# Altium schematic sheet Sensored BLDC Driver PCB.SchDoc
size A4; SheetNumber: 1; SheetTotal: 5
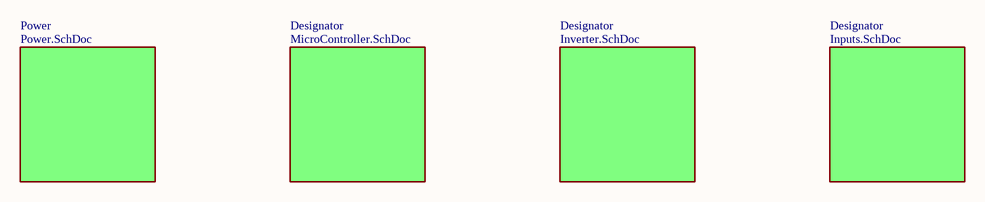
[diagram p0: Sensored BLDC Driver PCB.SchDoc]

## Sub-sheets
Designator = MicroController.SchDoc: no entries
Designator = Inverter.SchDoc: no entries
Designator = Inputs.SchDoc: no entries
Power = Power.SchDoc: no entries